# EAGLE design node (EAGLE 7.3.0)
Connected Hive Node Prototype model 2 DHT version 1 CHNM2V1 (c) New York Bee Sanctuary
CNAME: CONNECTED HIVE - NEW YORK BEE SANCTUARY; CREVISION: 0; DESIGNER: ANTOINE ARLAUD
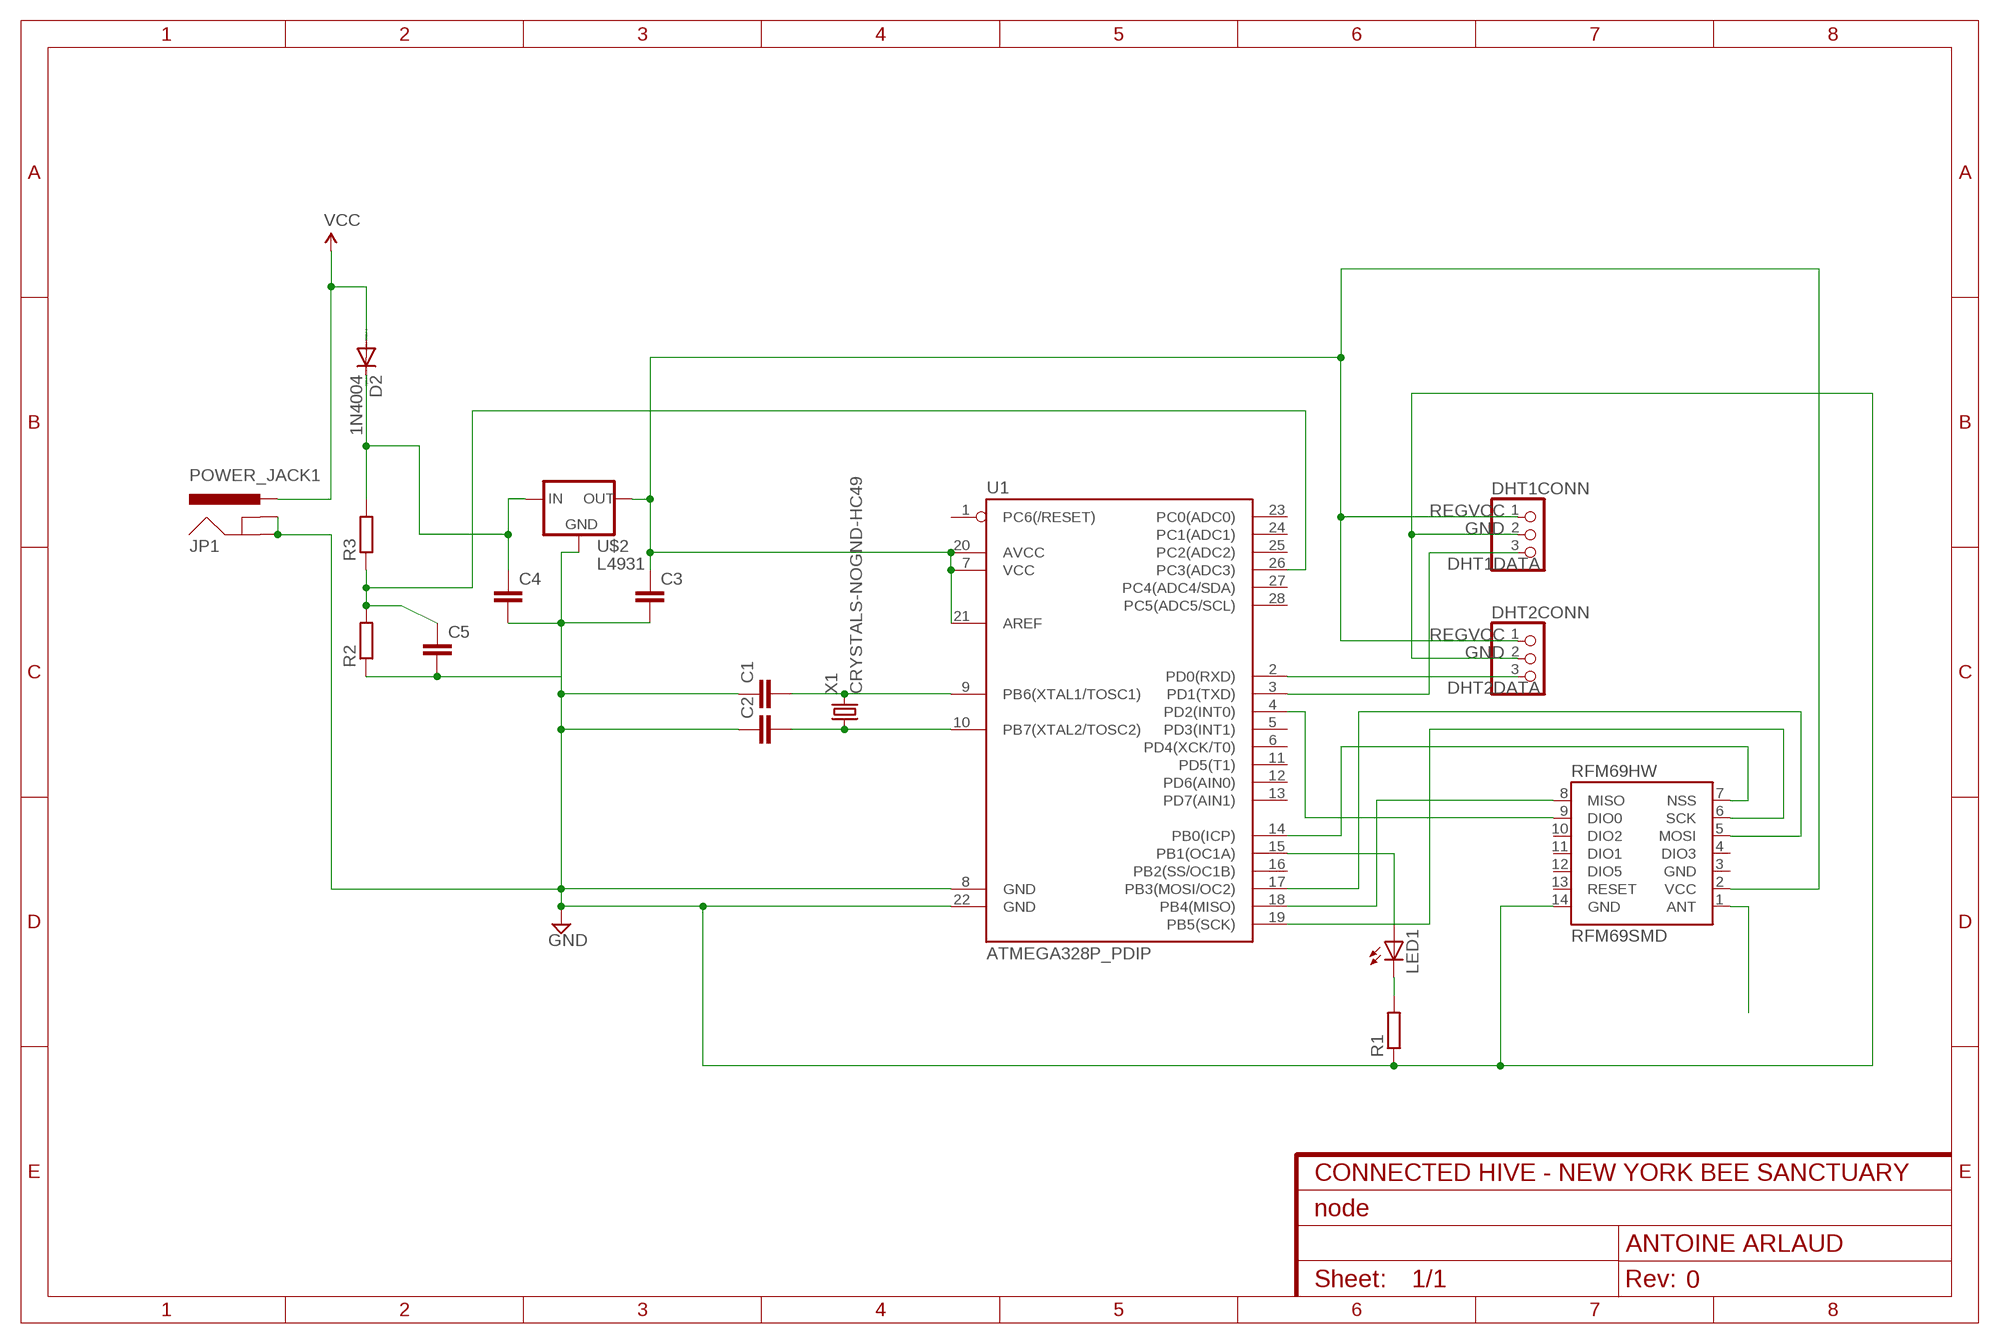
[diagram p0: schematic, sheet 1]

## Parts
C1  C-EU025-024X044  [C025-024X044]
C2  C-EU025-024X044  [C025-024X044]
C3  C-EU025-024X044  [C025-024X044]
C4  C-EU025-024X044  [C025-024X044]
C5  C-EU025-024X044  [C025-024X044]
D2  1N4004  [DO41-10]
DHT1CONN  PINHD-1X3  [1X03]
DHT2CONN  PINHD-1X3  [1X03]
JP1  POWER_JACK1  [POWER_JACK_SMD_OVERPASTE_REDBOARD_0603]
LED1  LED3MM  [LED3MM]
R1  R-EU_0207/10  [0207/10]
R2  R-EU_0207/10  [0207/10]
R3  R-EU_0207/10  [0207/10]
RFM69HW  RFM69SMD  [RFM69]
U1  ATMEGA328P_PDIP  [DIL28-3]
U$2  L4931  [TO92]
X1  CRYSTALS-NOGND-HC49  [HC49]

## Nets
DHT1DATA: DHT1CONN.3 U1.2(PD0(RXD))
DHT2DATA: DHT2CONN.3 U1.3(PD1(TXD))
GND: C1.1 C2.1 C3.2 C4.2 C5.2 DHT1CONN.2 DHT2CONN.2 JP1.GND(GNDBREAK) JP1.P$4(GND) R1.1 R2.1 RFM69HW.14(GND) U1.8(GND) U1.22(GND) U$2.GND
N$2: C1.2 U1.9(PB6(XTAL1/TOSC1)) X1.2
N$3: C2.2 U1.10(PB7(XTAL2/TOSC2)) X1.1
N$6: LED1.K(C) R1.2
N$7: LED1.A U1.15(PB1(OC1A))
N$8: C5.1 R2.2 R3.1 U1.26(PC3(ADC3))
N$10: RFM69HW.5(MOSI) U1.17(PB3(MOSI/OC2))
N$11: RFM69HW.8(MISO) U1.18(PB4(MISO))
N$14: RFM69HW.1(ANT)
N$15: RFM69HW.6(SCK) U1.19(PB5(SCK))
N$16: RFM69HW.7(NSS) U1.14(PB0(ICP))
N$17: RFM69HW.9(DIO0) U1.4(PD2(INT0))
REGVCC: C3.1 DHT1CONN.1 DHT2CONN.1 RFM69HW.2(VCC) U1.7(VCC) U1.20(AVCC) U1.21(AREF) U$2.OUT
VCC: C4.1 D2.A D2.C JP1.VIN0(PWR) R3.2 U$2.IN
Unconnected: RFM69HW.4(DIO3) RFM69HW.10(DIO2) RFM69HW.11(DIO1) RFM69HW.12(DIO5) U1.1(PC6(/RESET)) U1.5(PD3(INT1)) U1.6(PD4(XCK/T0)) U1.11(PD5(T1)) U1.12(PD6(AIN0)) U1.13(PD7(AIN1)) U1.16(PB2(SS/OC1B)) U1.23(PC0(ADC0)) U1.24(PC1(ADC1)) U1.25(PC2(ADC2)) U1.27(PC4(ADC4/SDA)) U1.28(PC5(ADC5/SCL))

## Power pins joined to a net without a drawn wire
GND: RFM69HW.3(GND)
RESET: RFM69HW.13(RESET)

## Library data of the parts
C1-C5 = resistor:C-EU: CAPACITOR, European symbol
D2 = diode:1N4004: DIODE general purpose rectifier, 1 A
DHT1CONN DHT2CONN = pinhead:PINHD-1X3: PIN HEADER
JP1 = SparkFun-Connectors:POWER_JACK: Power Jack This is the standard 5.5mm barrel jack for power. The PTH is the most common, proven, reliable, footprint. The Slot footprint only works if the mill layer is transmitted to the PCB fab house so be warned. Mating wall wart : TOL-00298 (and others)
LED1 = led:LED: LED OSRAM: - CHIPLED LG R971, LG N971, LY N971, LG Q971, LY Q971, LO R971, LY R971 LH N974, LH R974 LS Q976, LO Q976, LY Q976 LO Q996 - Hyper CHIPLED LW Q18S LB Q993, LB Q99A, LB R99A - SideLED LS A670, LO A670, LY A670, LG A670, LP A670 LB A673, LV A673, LT A673, LW A673 LH A674 LY A675 LS A676, LA A676, LO A676, LY A676, LW A676 LS A679, LY A679, LG A679 - Hyper Micro SIDELED® LS Y876, LA Y876, LO Y876, LY Y876 LT Y87S - SmartLED LW L88C, LW L88S LB L89C, LB L89S, LG L890 LS L89K, LO L89K, LY L89K LS L896, LA L896, LO L896, LY L896 - TOPLED LS T670, LO T670, LY T670, LG T670, LP T670 LSG T670, LSP T670, LSY T670, LOP T670, LYG T670 LG T671, LOG T671, LSG T671 LB T673, LV T673, LT T673, LW T673 LH T674 LS T676, LA T676, LO T676, LY T676, LB T676, LH T676, LSB T676, LW T676 LB T67C, LV T67C, LT T67C, LS T67K, LO T67K, LY T67K, LW E67C LS E67B, LA E67B, LO E67B, LY E67B, LB E67C, LV E67C, LT E67C LW T67C LS T679, LY T679, LG T679 LS T770, LO T770, LY T770, LG T770, LP T770 LB T773, LV T773, LT T773, LW T773 LH T774 LS E675, LA E675, LY E675, LS T675 LS T776, LA T776, LO T776, LY T776, LB T776 LHGB T686 LT T68C, LB T68C - Hyper Mini TOPLED® LB M676 - Mini TOPLED Santana® LG M470 LS M47K, LO M47K, LY M47K Source: http://www.osram.convergy.de LUXEON: - LUMILED® LXK2-PW12-R00, LXK2-PW12-S00, LXK2-PW14-U00, LXK2-PW14-V00 LXK2-PM12-R00, LXK2-PM12-S00, LXK2-PM14-U00 LXK2-PE12-Q00, LXK2-PE12-R00, LXK2-PE12-S00, LXK2-PE14-T00, LXK2-PE14-U00 LXK2-PB12-K00, LXK2-PB12-L00, LXK2-PB12-M00, LXK2-PB14-N00, LXK2-PB14-P00, LXK2-PB14-Q00 LXK2-PR12-L00, LXK2-PR12-M00, LXK2-PR14-Q00, LXK2-PR14-R00 LXK2-PD12-Q00, LXK2-PD12-R00, LXK2-PD12-S00 LXK2-PH12-R00, LXK2-PH12-S00 LXK2-PL12-P00, LXK2-PL12-Q00, LXK2-PL12-R00 Source: www.luxeon.com KINGBRIGHT: KA-3528ASYC Source: www.kingbright.com
R1-R3 = resistor:R-EU_: RESISTOR, European symbol
RFM69HW = RFM69:RFM69: The RFM22 is a low-power, low cost radio that is capable of operating in the 434MHz and 900MHz open bands. It's frequency is software defined and there are some very good libraries written for it.
U1 = SparkFun-DigitalIC:ATMEGA328P_PDIP: uC used in the Arduino 32kb flash, 1k EEPROM, 2k SRAM This is the through-hole version of this chip.
U$2 = ConnectedHive:L4931: L4931 Low drop voltage converter TO92 package Datasheet at https://www.adafruit.com/images/product-files/2236/2236.pdf
X1 = IQD-Frequency-Products:CRYSTALS-NOGND: CRYSTALS CAN NOT GROUNDED

## Board
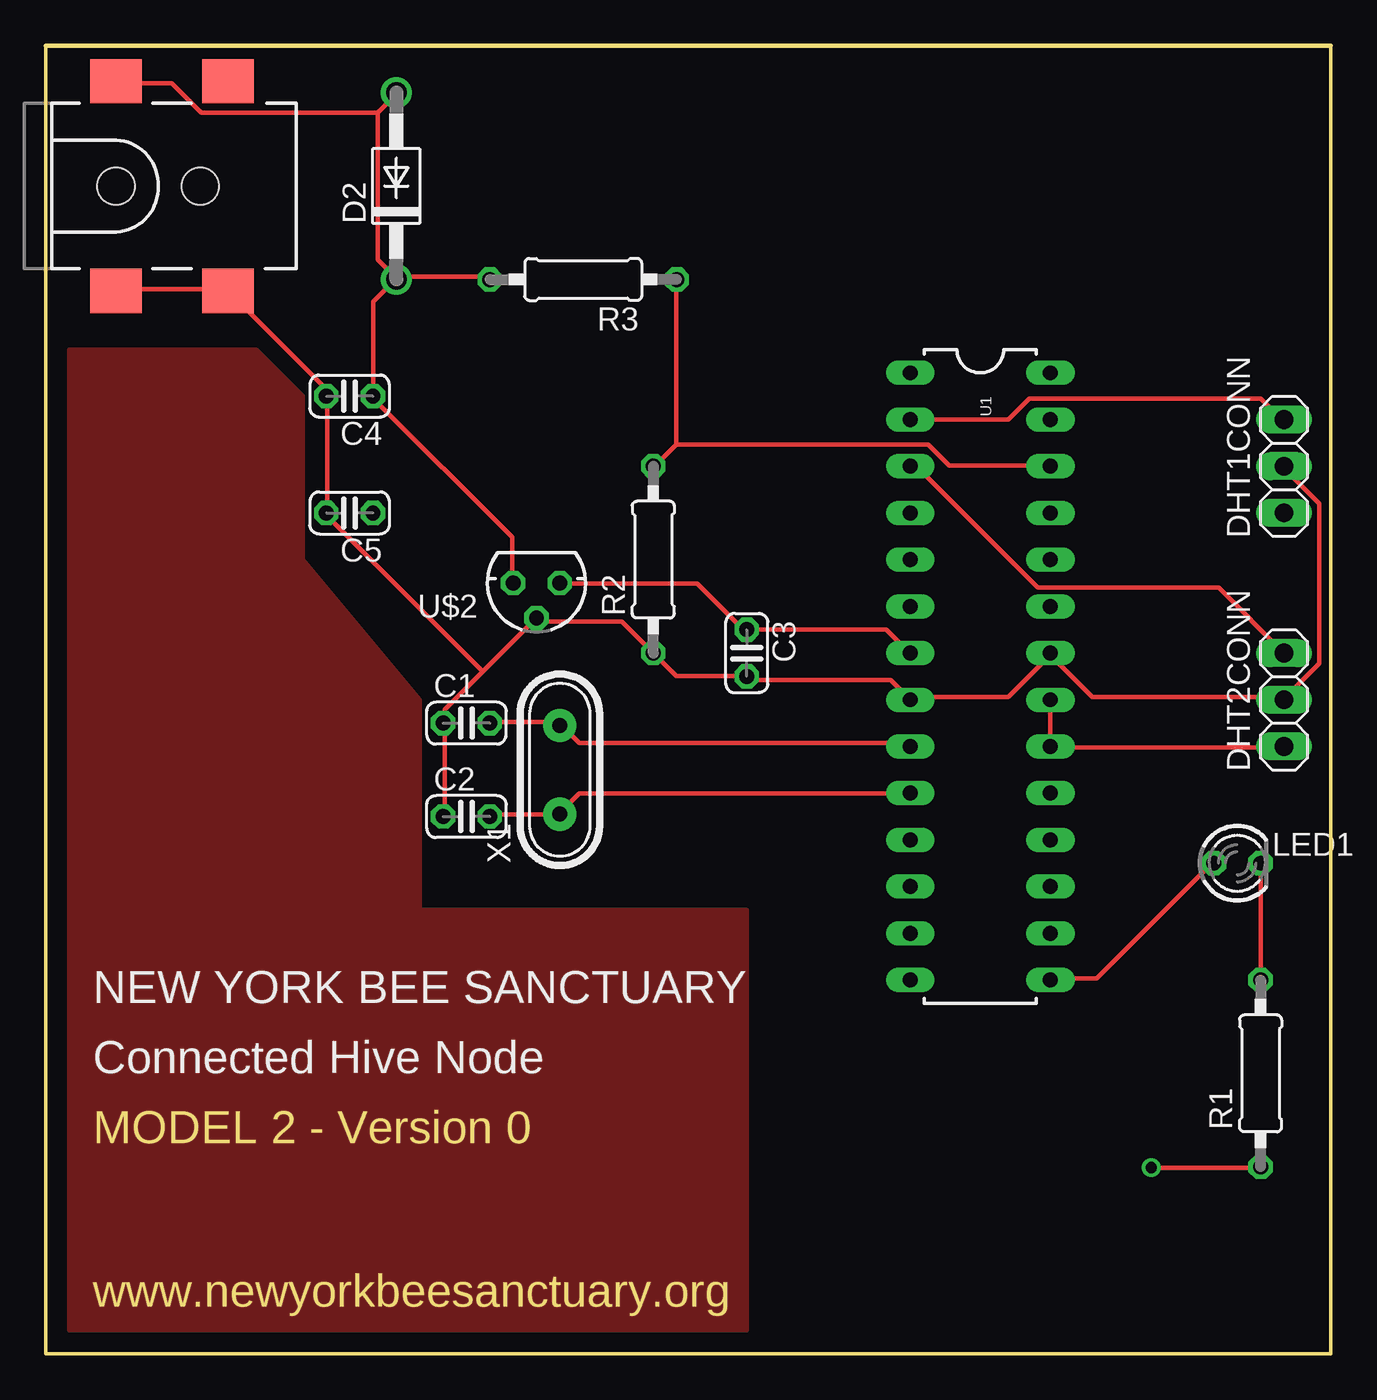
[diagram p1: board, top side]
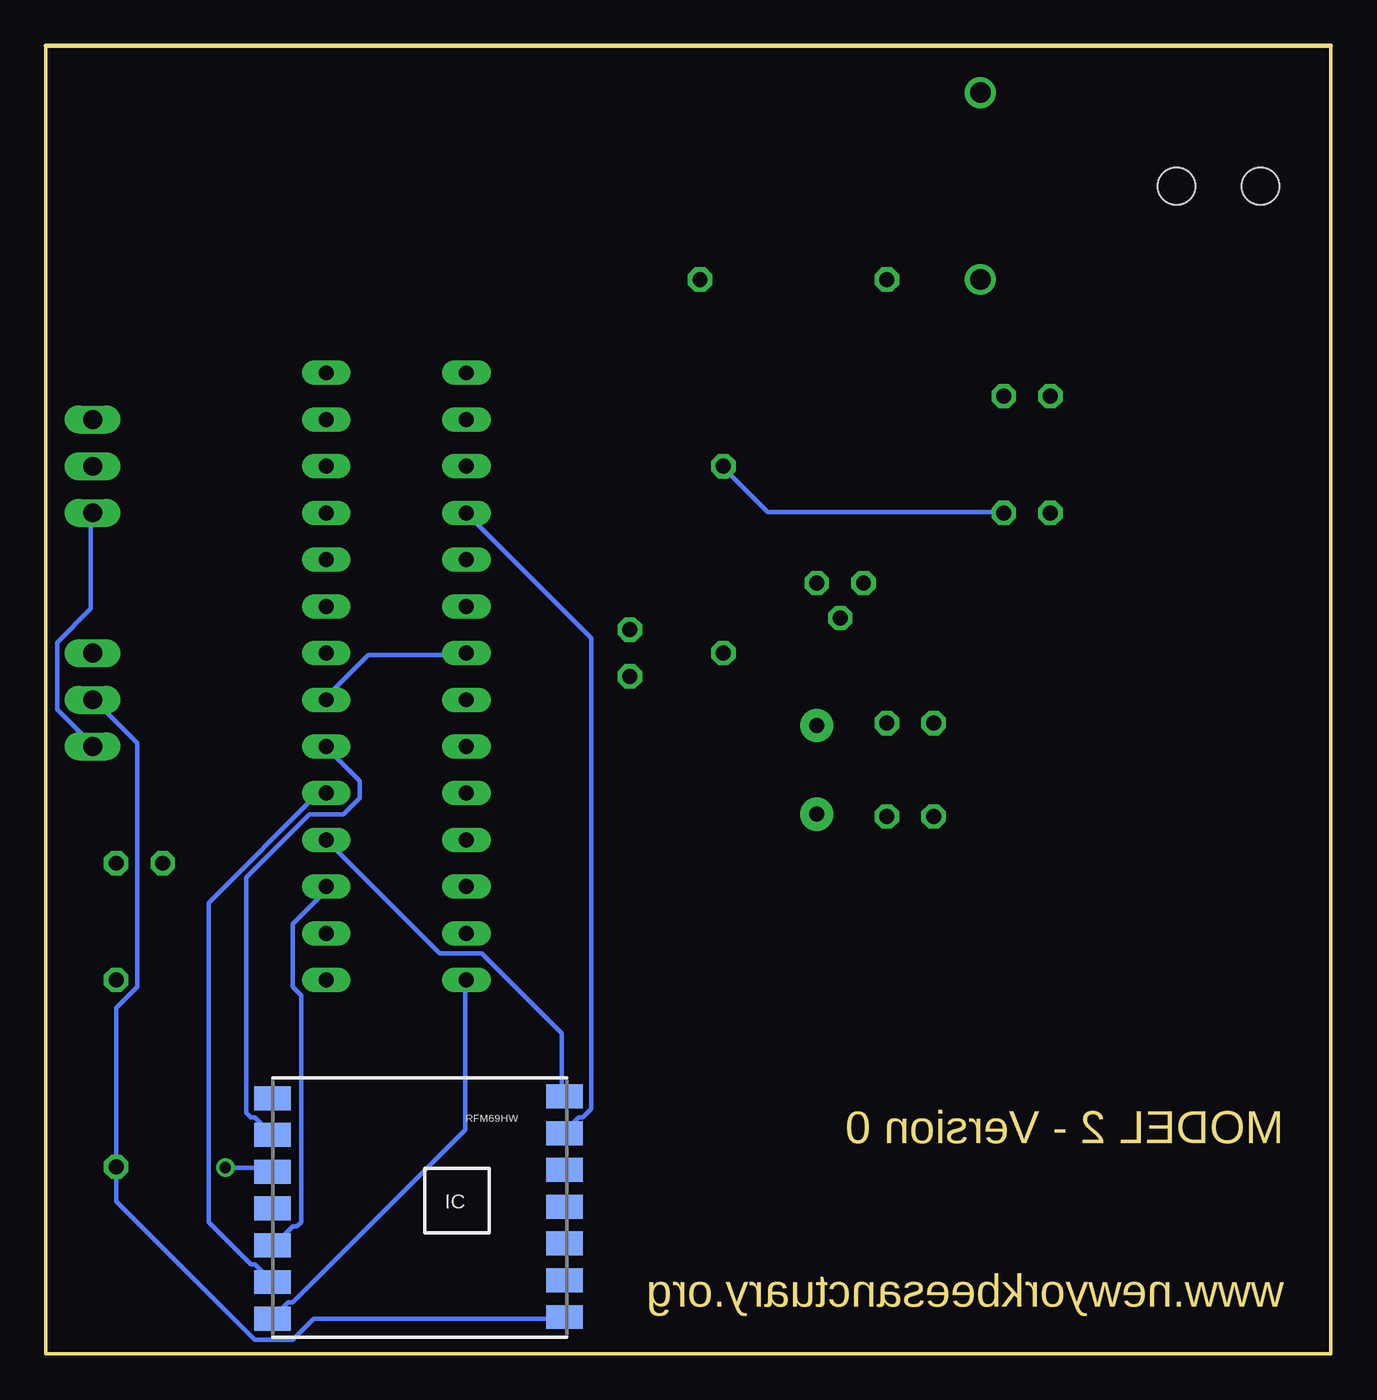
[diagram p2: board, bottom side, seen from below]

Size 69.85 x 71.12 mm. Coordinates in mm from the lower left corner, seen from the top.
Outline: 0,71.12 0,0 69.85,0 69.85,71.12 0,71.12
Copper layers (1*16): Top 0.035mm / dielectric 1.5mm / Bottom 0.035mm
Design rules "default": minimum track width 10mil, minimum drill 24mil, track to track 8mil, track to pad 8mil, pad to pad 8mil, via to via 8mil, smd to smd 8mil, copper to edge 40mil, drill to drill 8mil, minimum pad ring 10mil, minimum via ring 8mil, stop-mask expansion 4mil, vias tented up to drill 0mil, thermal gap 10mil

### Footprints (pad centres in the part's own frame; a part is rotated, then mirrored left to right if it is on the bottom)
C025-024X044 = drill 0.813 octagon: 1 -1.27,0; 2 1.27,0
DO41-10 = drill 1.118: A 5.08,0; C -5.08,0
1X03 = drill 1.016 long: 1 -2.54,0; 2 0,0; 3 2.54,0
POWER_JACK_SMD_OVERPASTE_REDBOARD_0603 = smd 2.8 x 2.4: GND 0,-5.7; P$4 6.1,-5.7; VIN0 0,5.7; VIN1 6.1,5.7 | hole 2.032: 0,0; 4.572,0
LED3MM = drill 0.813 octagon: A -1.27,0; K 1.27,0
0207/10 = drill 0.813 octagon: 1 -5.08,0; 2 5.08,0
RFM69 = smd 2 x 1.3: 1 8,-6.27; 2 8,-4.27; 3 8,-2.27; 4 8,-0.27; 5 8,1.73; 6 8,3.73; 7 8,5.73; 8 -7.875,-6.365; 9 -7.875,-4.365; 10 -7.875,-2.365; 11 -7.875,-0.365; 12 -7.875,1.635; 13 -7.875,3.635; 14 -7.875,5.635
DIL28-3 = drill 0.813 long: 1 -16.51,-3.81; 2 -13.97,-3.81; 3 -11.43,-3.81; 4 -8.89,-3.81; 5 -6.35,-3.81; 6 -3.81,-3.81; 7 -1.27,-3.81; 8 1.27,-3.81; 9 3.81,-3.81; 10 6.35,-3.81; 11 8.89,-3.81; 12 11.43,-3.81; 13 13.97,-3.81; 14 16.51,-3.81; 15 16.51,3.81; 16 13.97,3.81; 17 11.43,3.81; 18 8.89,3.81; 19 6.35,3.81; 20 3.81,3.81; 21 1.27,3.81; 22 -1.27,3.81; 23 -3.81,3.81; 24 -6.35,3.81; 25 -8.89,3.81; 26 -11.43,3.81; 27 -13.97,3.81; 28 -16.51,3.81
TO92 = drill 0.813 octagon: GND -8.89,1.905; IN -7.62,0; OUT -10.16,0
HC49 = drill 0.813 pad 1.8: 1 -2.413,0; 2 2.413,0

### Placement (x,y rotation side)
C1  22.86,34.29 0 top
C2  22.86,29.21 0 top
C3  38.1,38.1 270 top
C4  16.51,52.07 180 top
C5  16.51,45.72 180 top
D2  19.05,63.5 90 top
DHT1CONN  67.31,48.26 90 top
DHT2CONN  67.31,35.56 90 top
JP1  3.81,63.5 0 top
LED1  64.77,26.67 0 top
R1  66.04,15.24 90 top
R2  33.02,43.18 90 top
R3  29.21,58.42 180 top
RFM69HW  49.53,7.62 180 bottom
U1  50.8,36.83 270 top
U$2  17.78,41.91 180 top
X1  27.94,31.75 90 top

### Tracks (layer width: path | path; a pad name or v marks a point on that pad's centre or on a via)
DHT1DATA
  Top 0.254: U1.2 52.32,50.8 53.47,51.94 66.04,51.94 67.18,50.8 DHT1CONN.3
DHT2DATA
  Top 0.254: DHT2CONN.3 63.75,41.66 53.92,41.66 47.52,48.06 47.07,48.06 U1.3
GND  (via drill 0.61)
  Top 0.254: JP1.GND 3.86,57.89 9.8,57.89 JP1.P$4 10.03,57.66 15.06,52.63 15.06,52.17 C4.2 15.29,51.94 15.29,45.77 C5.2 15.29,45.54 23.75,37.08 | C2.1 21.69,29.31 21.69,34.11 C1.1 21.69,34.34 21.69,35.03 23.75,37.08 | 23.75,37.08 U$2.GND 26.72,39.83 31.29,39.83 R2.1 34.27,36.85 37.92,36.85 C3.2 38.15,36.63 45.92,36.63 U1.8 47.07,35.71 52.32,35.71 54.61,38 | v60.1,10.11 66.04,10.11 R1.1 | 54.61,38 56.9,35.71 67.18,35.71 DHT2CONN.2 67.41,35.71 69.24,37.54 69.24,46.23 67.41,48.06 DHT1CONN.2 | 54.61,38 U1.22
  Bottom 0.254: RFM69HW.14 41.81,1.88 55.3,1.88 56.44,0.74 58.5,0.74 66.04,8.28 R1.1 66.04,18.8 64.9,19.94 64.9,33.2 67.18,35.48 DHT2CONN.2 | v60.1,10.11 57.58,10.11 RFM69HW.3
N$1
  pour Top: 1.27,54.61 1.27,1.27 38.1,1.27 38.1,24.13 20.32,24.13 20.32,35.56 13.97,43.18 13.97,52.07 11.43,54.61
N$2
  Top 0.254: U1.9 46.84,33.2 29.01,33.2 28.09,34.11 X1.2 27.86,34.34 24.21,34.34 C1.2
N$3
  Top 0.254: C2.2 24.21,29.31 27.86,29.31 X1.1 28.09,29.54 29.01,30.45 46.84,30.45 U1.10
N$6
  Top 0.254: LED1.K R1.2
N$7
  Top 0.254: U1.15 54.61,20.4 57.12,20.4 63.3,26.57 LED1.A
N$8
  Top 0.254: 34.27,49.43 34.27,58.34 R3.1 | 34.27,49.43 33.12,48.28 R2.2 | 34.27,49.43 47.98,49.43 49.12,48.28 54.61,48.28 U1.26
  Bottom 0.254: C5.1 17.8,45.77 30.61,45.77 32.89,48.06 R2.2
N$10
  Bottom 0.254: RFM69HW.5 57.35,5.99 56.44,6.91 56.21,6.91 55.98,7.14 55.98,19.48 56.44,19.94 56.44,23.37 54.61,25.2 U1.17
N$11
  Bottom 0.254: U1.18 48.44,21.77 46.15,21.77 41.81,17.42 41.81,13.99 RFM69HW.8
N$15
  Bottom 0.254: RFM69HW.6 57.58,3.94 58.5,4.85 58.73,4.85 61.01,7.14 61.01,24.51 55.07,30.45 54.61,30.45 U1.19
N$16
  Bottom 0.254: RFM69HW.7 57.35,2.11 56.67,2.79 56.44,2.79 47.07,12.17 47.07,20.17 U1.14
N$17
  Bottom 0.254: RFM69HW.9 41.58,12.17 40.89,12.85 40.66,12.85 40.21,13.31 40.21,38.91 46.84,45.54 U1.4
REGVCC
  Top 0.254: U1.21 U1.20 54.61,32.97 67.18,32.97 DHT2CONN.1 | U1.7 46.84,38.23 45.7,39.37 C3.1 37.92,39.37 35.41,41.88 28.09,41.88 U$2.OUT
  Bottom 0.254: RFM69HW.2 57.58,11.94 58.5,12.85 58.73,12.85 58.95,13.08 58.95,25.88 55.52,29.31 53.7,29.31 52.78,30.23 52.78,31.14 54.61,32.97 U1.20 | U1.7 47.07,38 52.32,38 54.61,35.71 U1.21 | DHT1CONN.1 67.41,45.54 67.41,40.51 69.24,38.68 69.24,35.03 67.41,33.2 DHT2CONN.1
VCC
  Top 0.254: 18.03,67.49 8.43,67.49 6.83,69.09 3.86,69.09 JP1.VIN0 | 18.03,67.49 18.95,68.4 D2.A | D2.C 18.95,58.34 17.8,57.2 17.8,52.17 C4.1 17.8,51.94 25.35,44.4 25.35,42.11 U$2.IN | R3.2 23.98,58.57 19.18,58.57 D2.C | 18.03,67.49 18.03,59.49 18.95,58.57 D2.C

### Text on the board
Dimension: MODEL 2 - Version 0 | www.newyorkbeesanctuary.org
tPlace: NEW YORK BEE SANCTUARY | Connected Hive Node